# EAGLE design AVRI2CIO_V0_2_TOPLEVEL (EAGLE 6.5.0)
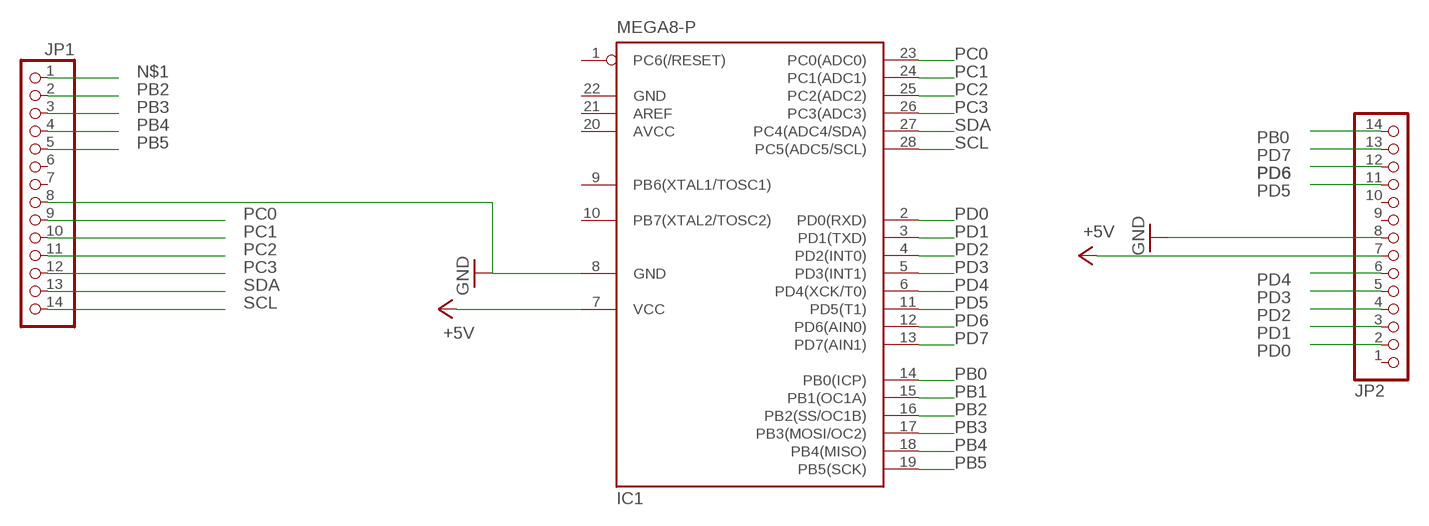
[diagram p0: schematic, sheet 1]

## Parts
IC1  MEGA8-P  [DIL28-3]
JP1  PINHD-1X14  [1X14]
JP2  PINHD-1X14  [1X14]

## Nets
+5V: IC1.7(VCC) JP2.7
GND: IC1.8(GND) JP1.8 JP2.8
N$1: JP1.1
PB0: IC1.14(PB0(ICP)) JP2.14
PB1: IC1.15(PB1(OC1A))
PB2: IC1.16(PB2(SS/OC1B)) JP1.2
PB3: IC1.17(PB3(MOSI/OC2)) JP1.3
PB4: IC1.18(PB4(MISO)) JP1.4
PB5: IC1.19(PB5(SCK)) JP1.5
PC0: IC1.23(PC0(ADC0)) JP1.9
PC1: IC1.24(PC1(ADC1)) JP1.10
PC2: IC1.25(PC2(ADC2)) JP1.11
PC3: IC1.26(PC3(ADC3)) JP1.12
PD0: IC1.2(PD0(RXD)) JP2.2
PD1: IC1.3(PD1(TXD)) JP2.3
PD2: IC1.4(PD2(INT0)) JP2.4
PD3: IC1.5(PD3(INT1)) JP2.5
PD4: IC1.6(PD4(XCK/T0)) JP2.6
PD5: IC1.11(PD5(T1)) JP2.11
PD6: IC1.12(PD6(AIN0)) JP2.12
PD7: IC1.13(PD7(AIN1)) JP2.13
SCL: IC1.28(PC5(ADC5/SCL)) JP1.14
SDA: IC1.27(PC4(ADC4/SDA)) JP1.13
Unconnected: IC1.1(PC6(/RESET)) IC1.9(PB6(XTAL1/TOSC1)) IC1.10(PB7(XTAL2/TOSC2)) IC1.21(AREF) JP1.6 JP1.7 JP2.1 JP2.9 JP2.10

## Power pins joined to a net without a drawn wire
AVCC: IC1.20(AVCC)
GND: IC1.22(GND)

## Library data of the parts
IC1 = atmel:MEGA8-P: MICROCONTROLLER 8 Kbytes FLASH, 1 kbytes SRAM, 512 bytes EEPROM, USART, 4-channel 10 bit ADC, 2-channel 8 bit ADC Pin compatible with Atmega48, ATMega88, ATMega168 Source: avr.lbr; OC_FARNELL: unknown; OC_NEWARK: unknown
JP1 JP2 = pinhead:PINHD-1X14: PIN HEADER

## Board
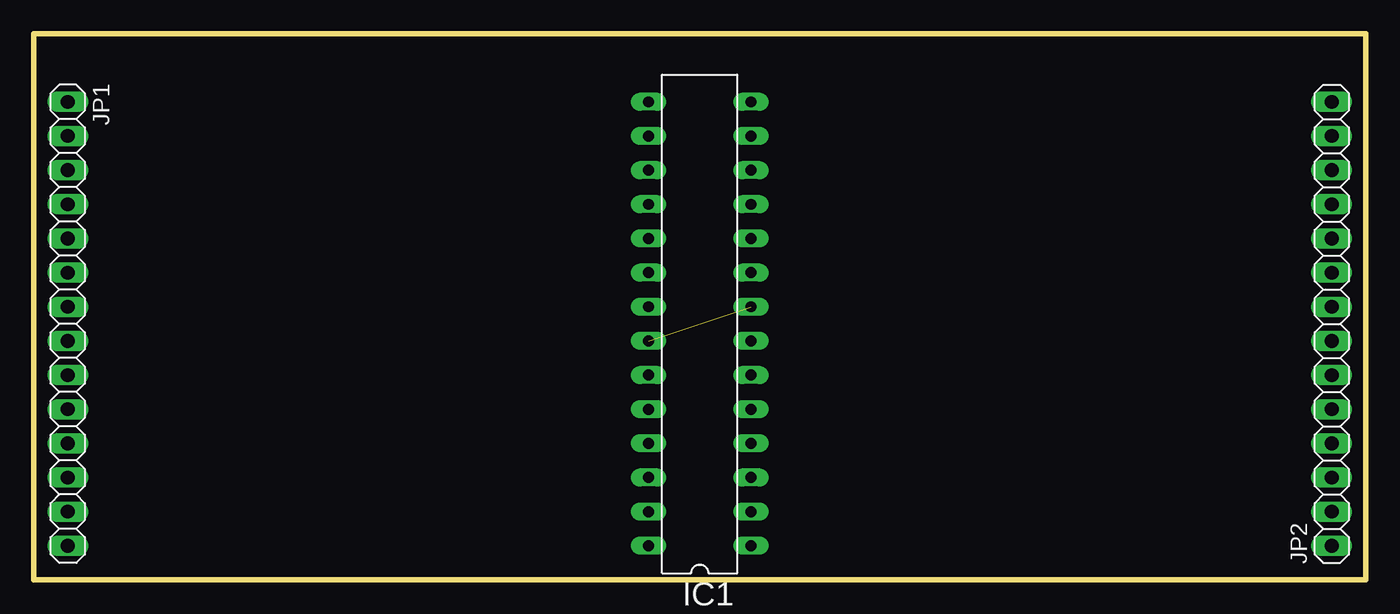
[diagram p1: board, top side]
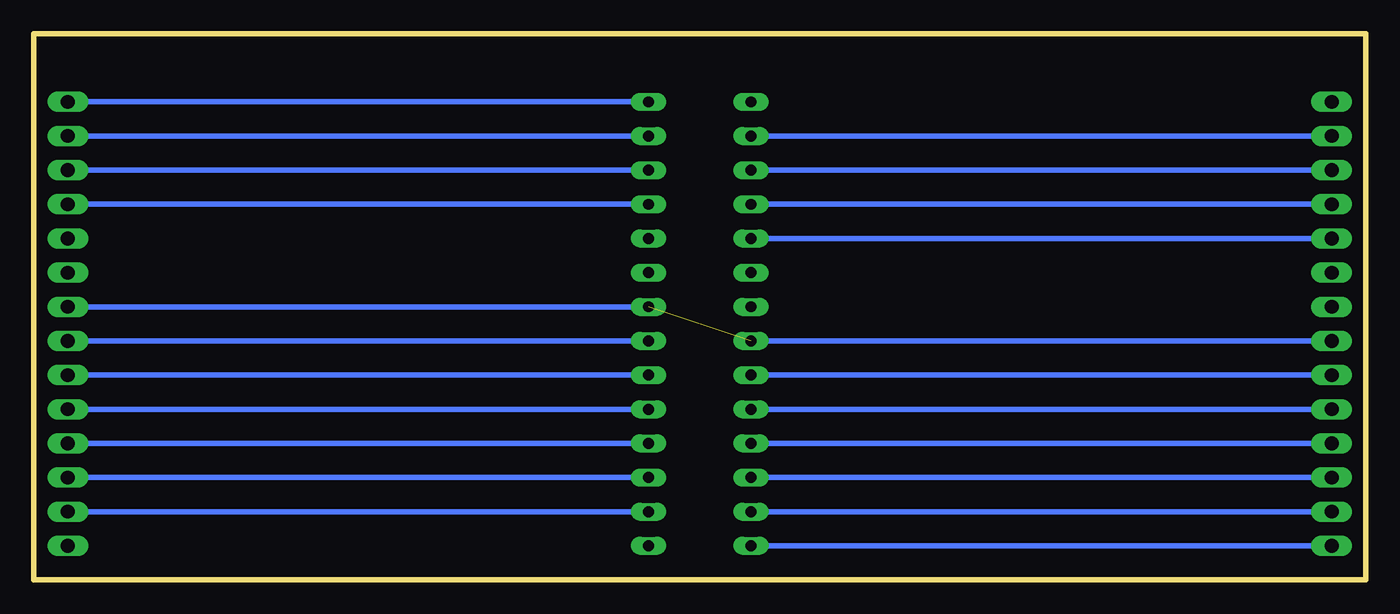
[diagram p2: board, bottom side, seen from below]

Size 99.06 x 40.64 mm. Coordinates in mm from the lower left corner, seen from the top.
Outline: 0,0 99.06,0 99.06,40.64 0,40.64 0,0
Copper layers (1*16): Top 0.035mm / dielectric 1.5mm / Bottom 0.035mm
Design rules "default": minimum track width 10mil, minimum drill 24mil, track to track 8mil, track to pad 8mil, pad to pad 8mil, via to via 8mil, smd to smd 8mil, copper to edge 40mil, drill to drill 8mil, minimum pad ring 10mil, minimum via ring 8mil, stop-mask expansion 4mil, vias tented up to drill 0mil, thermal gap 10mil

### Footprints (pad centres in the part's own frame; a part is rotated, then mirrored left to right if it is on the bottom)
DIL28-3 = drill 0.813 long: 1 -16.51,-3.81; 2 -13.97,-3.81; 3 -11.43,-3.81; 4 -8.89,-3.81; 5 -6.35,-3.81; 6 -3.81,-3.81; 7 -1.27,-3.81; 8 1.27,-3.81; 9 3.81,-3.81; 10 6.35,-3.81; 11 8.89,-3.81; 12 11.43,-3.81; 13 13.97,-3.81; 14 16.51,-3.81; 15 16.51,3.81; 16 13.97,3.81; 17 11.43,3.81; 18 8.89,3.81; 19 6.35,3.81; 20 3.81,3.81; 21 1.27,3.81; 22 -1.27,3.81; 23 -3.81,3.81; 24 -6.35,3.81; 25 -8.89,3.81; 26 -11.43,3.81; 27 -13.97,3.81; 28 -16.51,3.81
1X14 = drill 1.016 long: 1 -16.51,0; 2 -13.97,0; 3 -11.43,0; 4 -8.89,0; 5 -6.35,0; 6 -3.81,0; 7 -1.27,0; 8 1.27,0; 9 3.81,0; 10 6.35,0; 11 8.89,0; 12 11.43,0; 13 13.97,0; 14 16.51,0

### Placement (x,y rotation side)
IC1  49.53,19.05 90 top
JP1  2.54,19.05 270 top
JP2  96.52,19.05 90 top

### Tracks (layer width: path | path; a pad name or v marks a point on that pad's centre or on a via)
+5V
  Bottom 0.406: IC1.7 JP2.7
GND  (1 unrouted)
  Bottom 0.406: JP1.8 IC1.22 | JP2.8 IC1.8
PB0
  Bottom 0.406: JP2.14 IC1.14
PB2
  Bottom 0.406: JP1.2 IC1.16
PB3
  Bottom 0.406: IC1.17 JP1.3
PB4
  Bottom 0.406: JP1.4 IC1.18
PB5
  Bottom 0.406: IC1.19 JP1.5
PC0
  Bottom 0.406: IC1.23 JP1.9
PC1
  Bottom 0.406: JP1.10 IC1.24
PC2
  Bottom 0.406: IC1.25 JP1.11
PC3
  Bottom 0.406: JP1.12 IC1.26
PD0
  Bottom 0.406: IC1.2 JP2.2
PD1
  Bottom 0.406: IC1.3 JP2.3
PD2
  Bottom 0.406: JP2.4 IC1.4
PD3
  Bottom 0.406: IC1.5 JP2.5
PD4
  Bottom 0.406: JP2.6 IC1.6
PD5
  Bottom 0.406: IC1.11 JP2.11
PD6
  Bottom 0.406: JP2.12 IC1.12
PD7
  Bottom 0.406: IC1.13 JP2.13
SCL
  Bottom 0.406: JP1.14 IC1.28
SDA
  Bottom 0.406: IC1.27 JP1.13